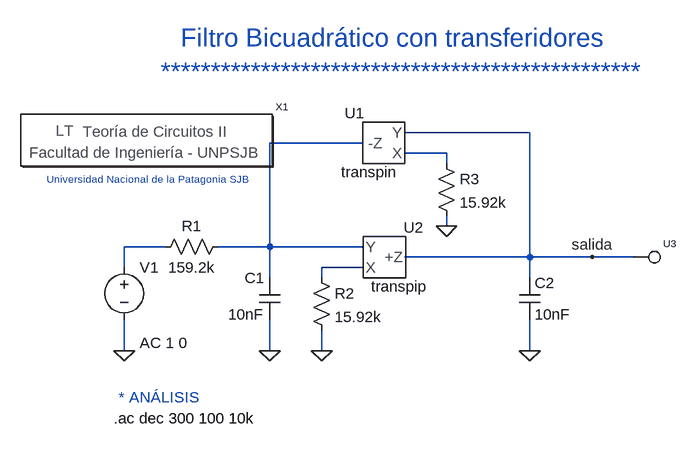
[diagram p0: schematic Filbro bicuadrático con transferidores.asc]
Filbro bicuadrático con transferidores.asc, the LTspice schematic file:
Version 4
SHEET 1 880 680
WIRE -752 -16 -944 -16
WIRE -1008 0 -1152 0
WIRE -880 16 -944 16
WIRE -880 32 -880 16
WIRE -880 128 -880 112
WIRE -1312 160 -1376 160
WIRE -1152 160 -1152 0
WIRE -1152 160 -1232 160
WIRE -1008 160 -1152 160
WIRE -752 176 -752 -16
WIRE -752 176 -944 176
WIRE -656 176 -752 176
WIRE -592 176 -656 176
WIRE -1376 192 -1376 160
WIRE -1008 192 -1072 192
WIRE -1152 208 -1152 160
WIRE -1072 208 -1072 192
WIRE -752 208 -752 176
WIRE -1376 320 -1376 272
WIRE -1152 320 -1152 272
WIRE -1072 320 -1072 288
WIRE -752 320 -752 272
FLAG -1376 320 0
FLAG -656 176 salida
FLAG -1152 320 0
FLAG -1072 320 0
FLAG -752 320 0
FLAG -880 128 0
SYMBOL res -1216 144 R90
WINDOW 0 0 56 VBottom 2
WINDOW 3 32 56 VTop 2
SYMATTR InstName R1
SYMATTR Value 159.2k
SYMBOL cap -1136 272 R180
WINDOW 0 24 64 Left 2
WINDOW 3 24 8 Left 2
SYMATTR InstName C1
SYMATTR Value 10nF
SYMBOL voltage -1376 176 R0
WINDOW 123 24 132 Left 2
WINDOW 39 0 0 Left 2
SYMATTR Value2 AC 1 0
SYMATTR InstName V1
SYMATTR Value ""
SYMBOL cap -768 208 R0
SYMATTR InstName C2
SYMATTR Value 10nF
SYMBOL transpin -976 -64 M0
SYMATTR InstName U1
SYMBOL transpip -976 112 R0
SYMATTR InstName U2
SYMBOL res -1088 192 R0
SYMATTR InstName R2
SYMATTR Value 15.92k
SYMBOL res -896 16 R0
SYMATTR InstName R3
SYMATTR Value 15.92k
SYMBOL Circuitos2\\Letreros\\Teoría\ de\ Circuitos\ II -1344 0 R0
SYMATTR InstName X1
SYMBOL Circuitos2\\Borneras\\Borne -576 176 R0
SYMATTR InstName U3
TEXT -1392 424 Left 2 !.ac dec 300 100 10k
TEXT -1384 392 Left 2 ;* ANÁLISIS
TEXT -1344 56 Center 1 ;Universidad Nacional de la Patagonia SJB
TEXT -960 -136 Center 4 ;Filtro Bicuadrático con transferidores\n************************************************

The netlist it stands for:
* Filbro bicuadrático con transferidores.asc
R1 N001 N003 159.2k
C1 0 N001 10nF
V1 N003 0 AC 1 0
C2 salida 0 10nF
XU1 salida N002 N001 transpin  ; pins Y X Z
XU2 N001 N004 salida transpip  ; pins Y X Z
R2 N004 0 15.92k
R3 N002 0 15.92k
XX1 Teoría de Circuitos II
XU3 salida borne  ; pins 1
.ac dec 300 100 10k
* * ANÁLISIS
* Universidad Nacional de la Patagonia SJB
* Filtro Bicuadrático con transferidores
* ************************************************
.lib ..\sym\Circuitos2\ComponentesIdeales\compoideales.lib
.lib ..\sym\Circuitos2\Borneras\borne.lib
.backanno
.end